# EAGLE schematic 中継tweite (EAGLE 9.6.2)
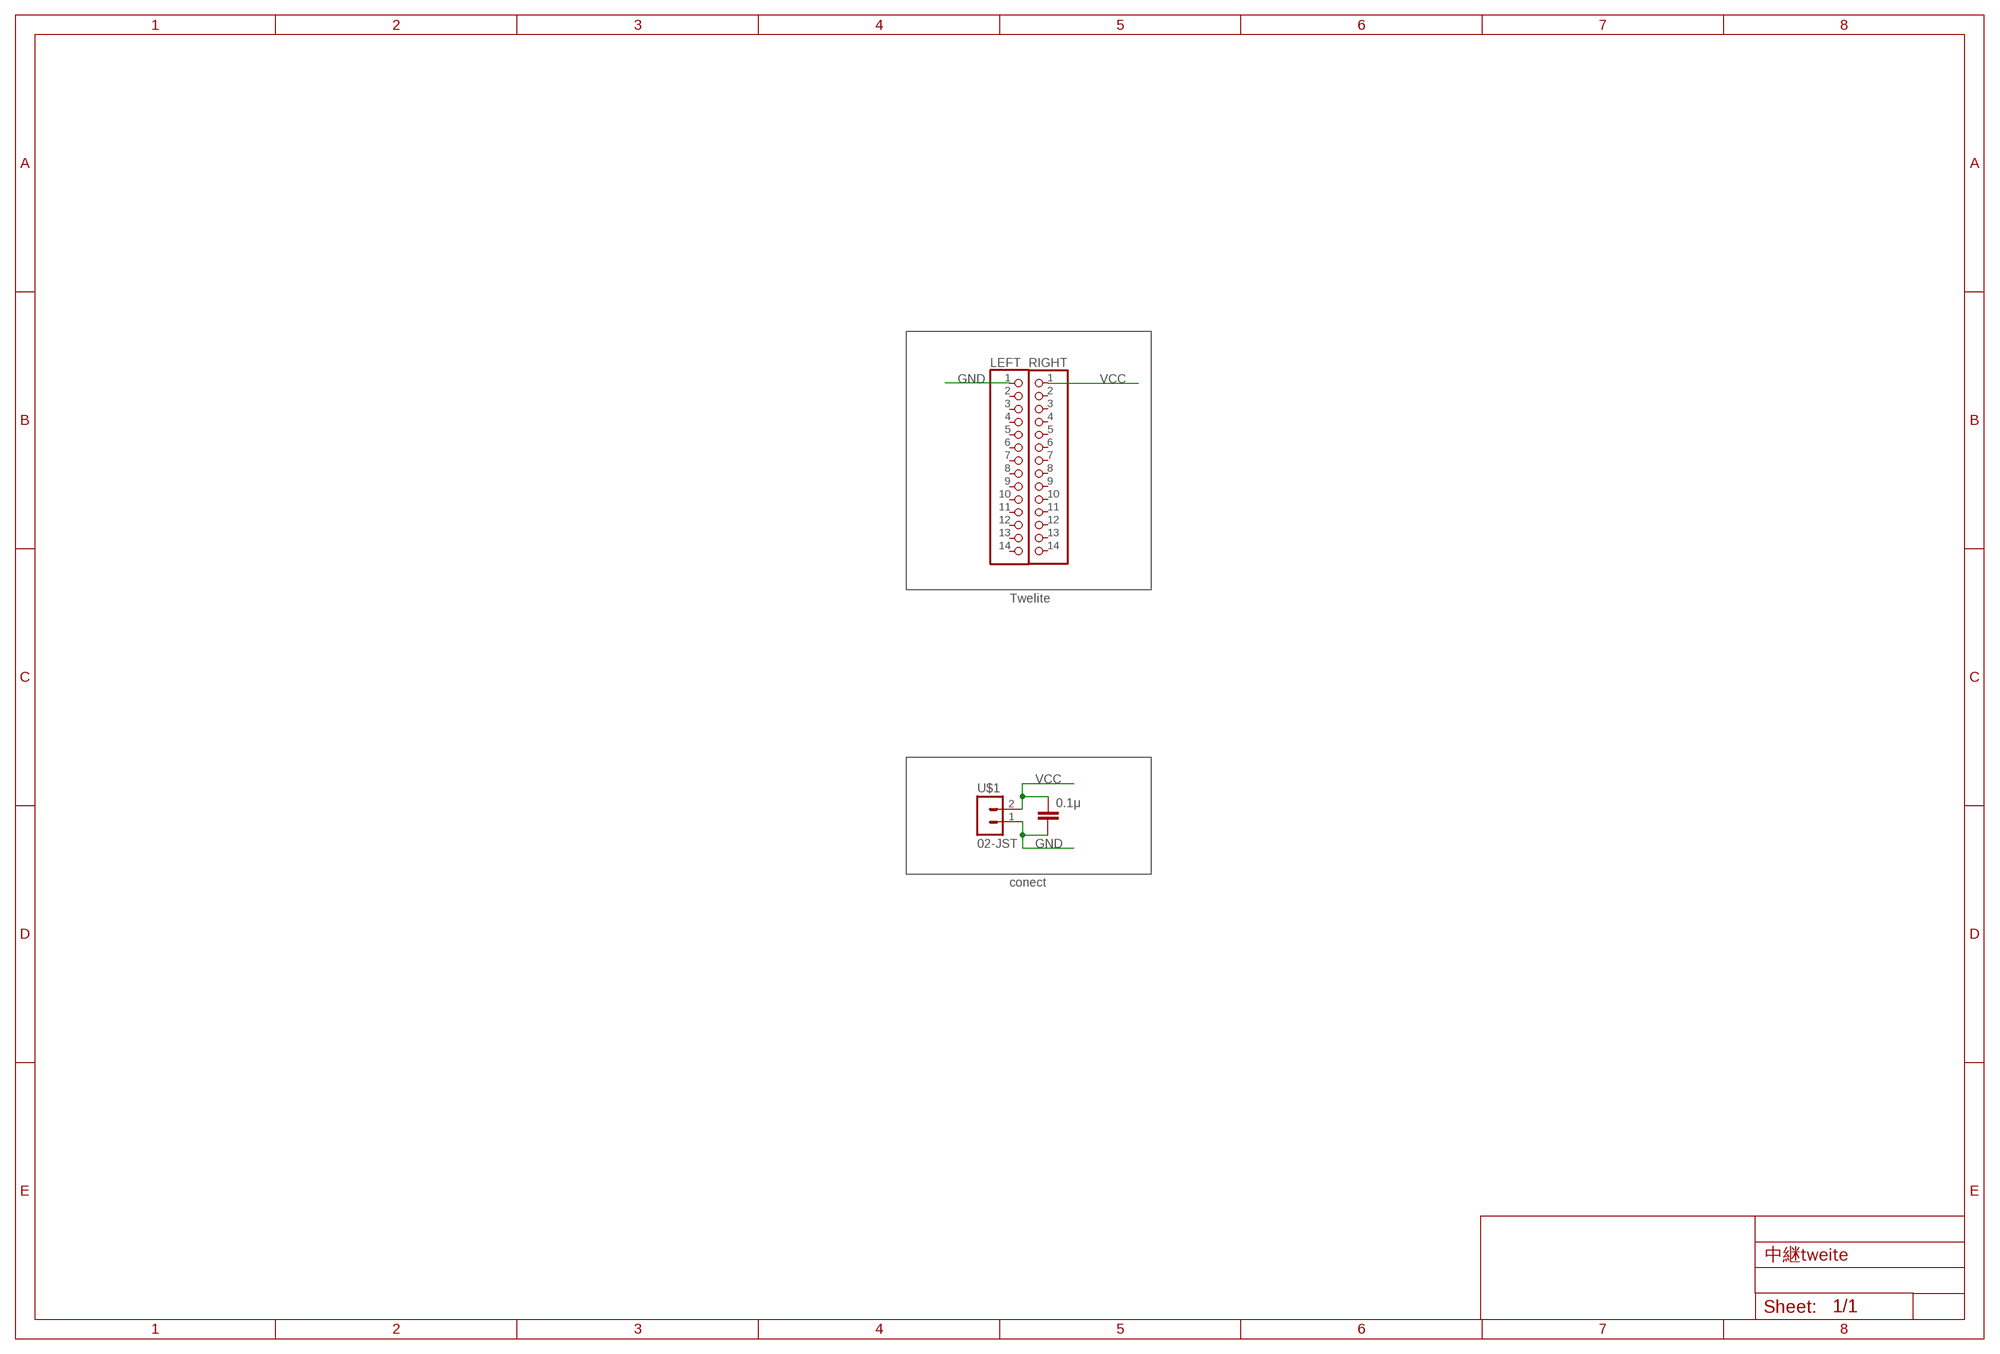
[diagram p0: schematic, sheet 1]

## Parts
0.1μ  C-EU025-024X044  [C025-024X044]
LEFT  PINHD-1X14  [1X14]
RIGHT  PINHD-1X14  [1X14]
U$1  02-JST  [B2B-XH]

## Nets
GND: 0.1μ.2 LEFT.1 U$1.1
VCC: 0.1μ.1 RIGHT.1 U$1.2
Unconnected: LEFT.2 LEFT.3 LEFT.4 LEFT.5 LEFT.6 LEFT.7 LEFT.8 LEFT.9 LEFT.10 LEFT.11 LEFT.12 LEFT.13 LEFT.14 RIGHT.2 RIGHT.3 RIGHT.4 RIGHT.5 RIGHT.6 RIGHT.7 RIGHT.8 RIGHT.9 RIGHT.10 RIGHT.11 RIGHT.12 RIGHT.13 RIGHT.14

## Notes on the sheet
- Twelite
- conect

## Library data of the parts
0.1μ = rcl:C-EU: CAPACITOR, European symbol; SPICEPREFIX: C
LEFT RIGHT = pinhead:PINHD-1X14: PIN HEADER
U$1 = con-jst-xh (1):02-JST: JST CONNECTOR